# Altium schematic sheet 0_ADSTM32-Overview.SchDoc
size A; SheetNumber: 1; SheetTotal: 4
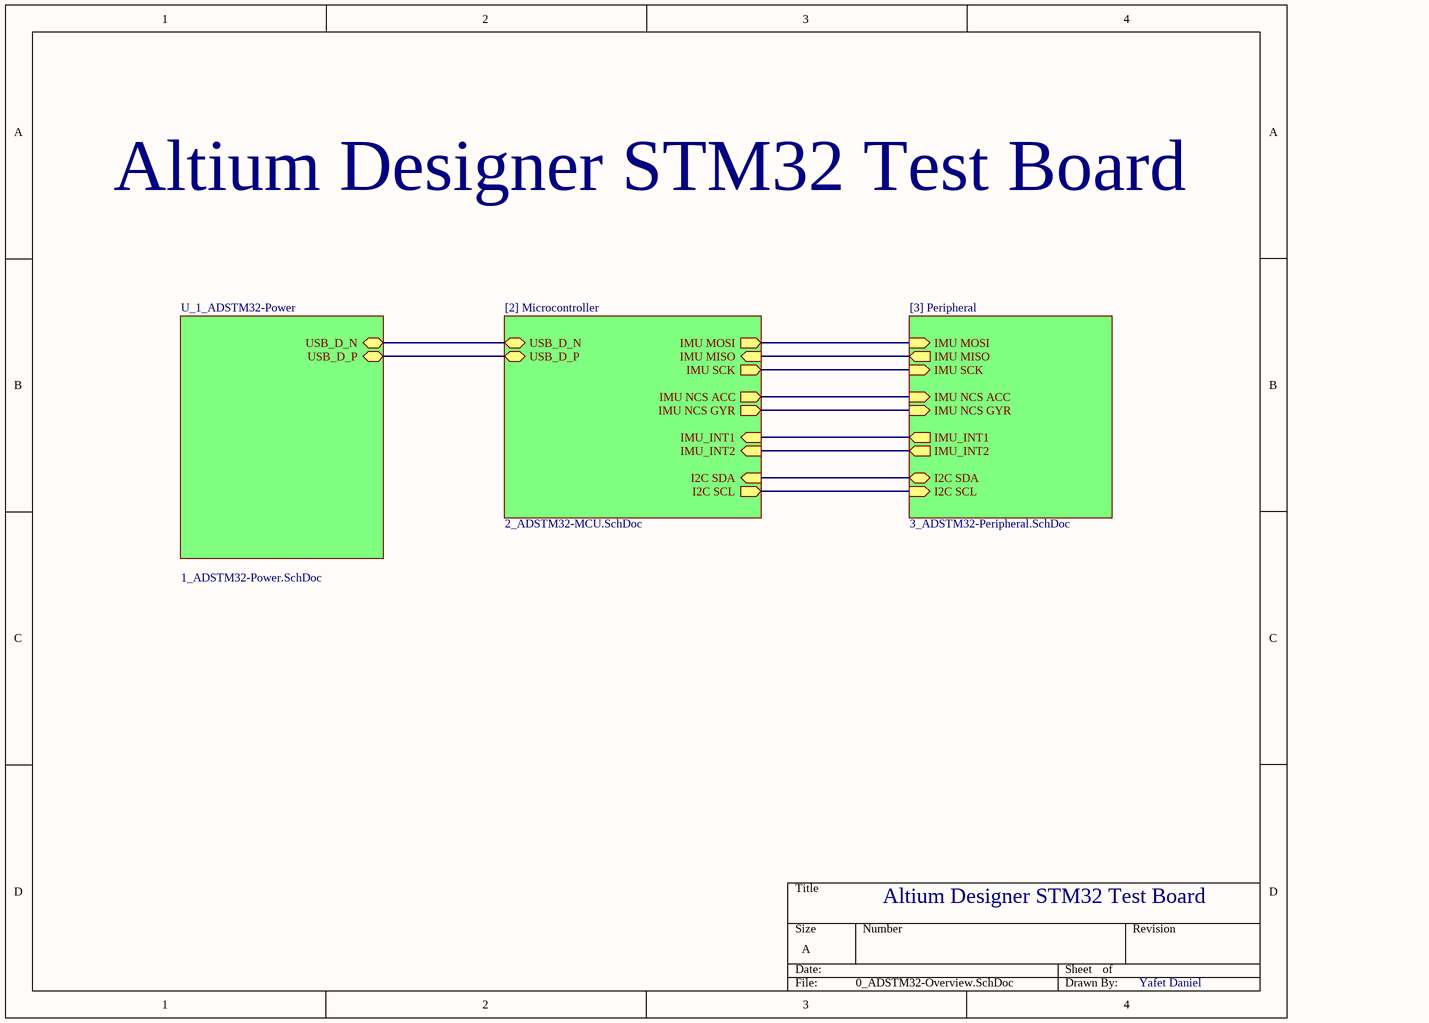
[diagram p0: 0_ADSTM32-Overview.SchDoc]

## Sub-sheets
[2] Microcontroller = 2_ADSTM32-MCU.SchDoc: USB_D_N (bidir), USB_D_P (bidir), IMU NCS ACC (out), IMU NCS GYR (out), IMU SCK (out), IMU MOSI (out), IMU MISO (in), I2C SCL (out), I2C SDA (in), IMU_INT1 (in), IMU_INT2 (in)
[3] Peripheral = 3_ADSTM32-Peripheral.SchDoc: IMU SCK (in), IMU MOSI (in), IMU MISO (out), IMU NCS ACC (in), IMU NCS GYR (in), IMU_INT1 (out), IMU_INT2 (out), I2C SCL (in), I2C SDA (bidir)
U_1_ADSTM32-Power = 1_ADSTM32-Power.SchDoc: USB_D_N (bidir), USB_D_P (bidir)

## Nets
(unnamed): sheet U_1_ADSTM32-Power/USB_D_N, sheet [2] Microcontroller/USB_D_N
(unnamed): sheet U_1_ADSTM32-Power/USB_D_P, sheet [2] Microcontroller/USB_D_P
(unnamed): sheet [3] Peripheral/IMU SCK, sheet [2] Microcontroller/IMU SCK
(unnamed): sheet [3] Peripheral/IMU MOSI, sheet [2] Microcontroller/IMU MOSI
(unnamed): sheet [3] Peripheral/IMU MISO, sheet [2] Microcontroller/IMU MISO
(unnamed): sheet [3] Peripheral/IMU NCS ACC, sheet [2] Microcontroller/IMU NCS ACC
(unnamed): sheet [3] Peripheral/IMU NCS GYR, sheet [2] Microcontroller/IMU NCS GYR
(unnamed): sheet [3] Peripheral/IMU_INT1, sheet [2] Microcontroller/IMU_INT1
(unnamed): sheet [3] Peripheral/IMU_INT2, sheet [2] Microcontroller/IMU_INT2
(unnamed): sheet [3] Peripheral/I2C SCL, sheet [2] Microcontroller/I2C SCL
(unnamed): sheet [3] Peripheral/I2C SDA, sheet [2] Microcontroller/I2C SDA

## Notes on the sheet
- Altium Designer STM32 Test Board
- Yafet Daniel